# Altium schematic sheet LKS_0313-V1.0.SchDoc: LKS034DO_FOC_MOTOR
size C; Date: 20220518; DrawnBy: WPJ; Organization: PuXun Tech Co.Ltd.; Revision: V1.0; PageSetup: Record=PageOptions?CenterHorizontal=True?CenterVertical=True?PrintScale=0.54?XCorrection=1.00?YCorrection=1.00?PrintKind=0?BorderSize=5000000?LeftOffset=0?BottomOffset=0?Orientation=2?PaperLength=1000?PaperWidth=1000?Scale=100?PaperSource=7?PrintQuality=-4?MediaType=1?DitherType=10?PaperKind=A4?PrintScaleMode=1
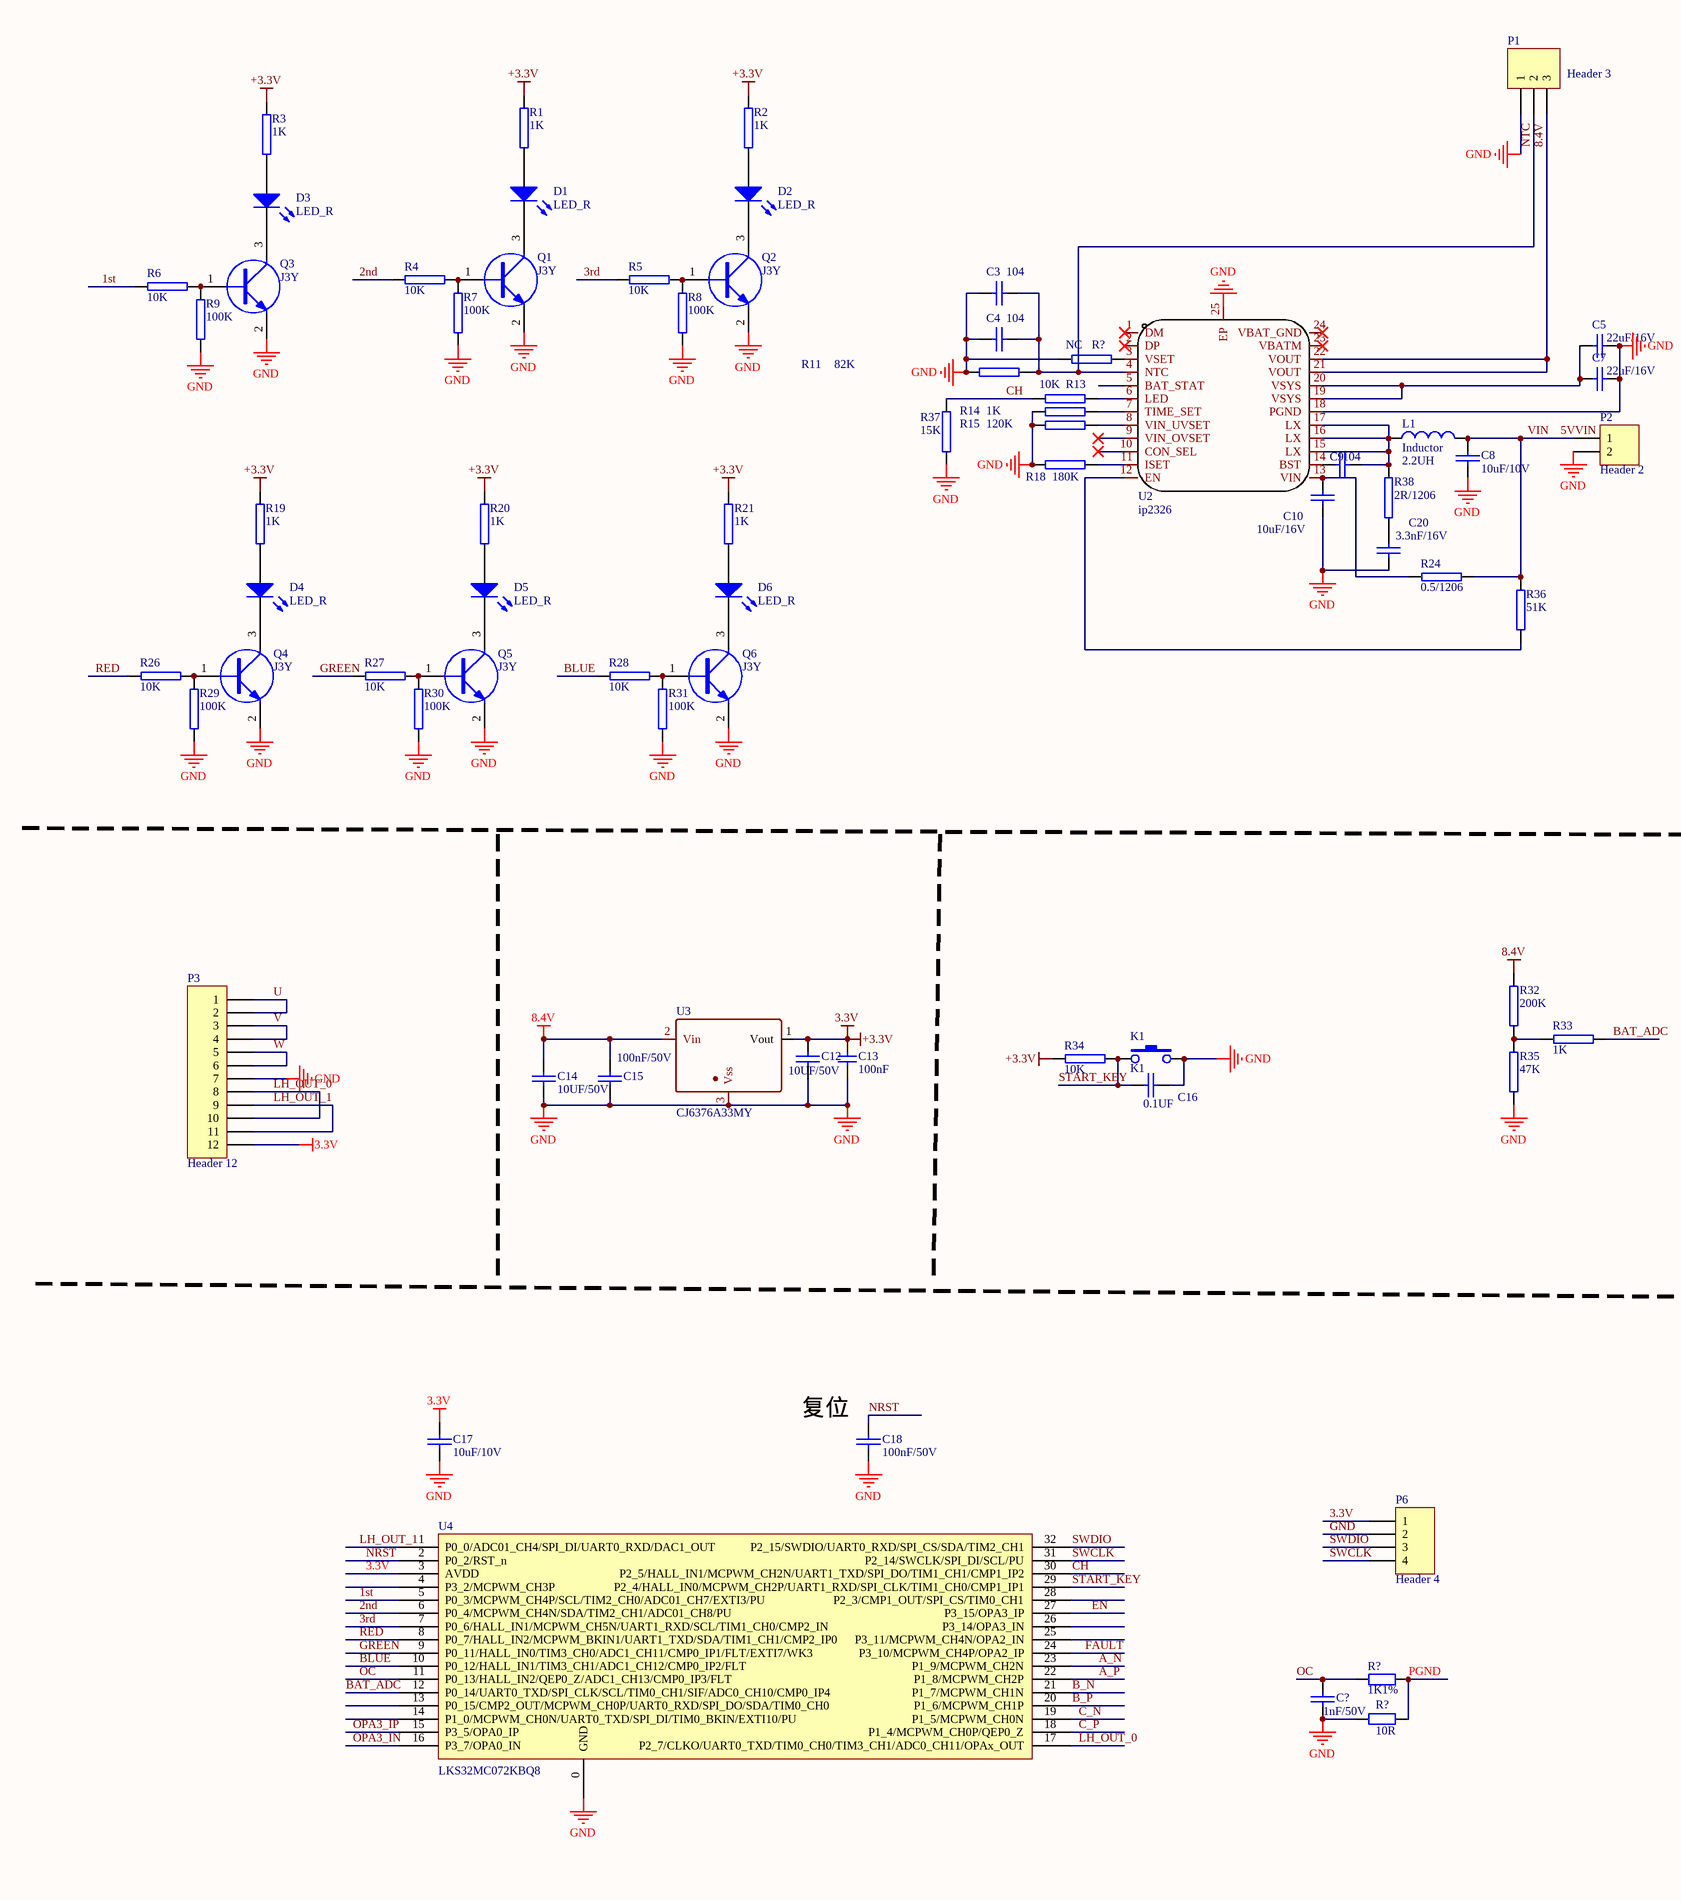
[diagram p0: LKS_0313-V1.0.SchDoc, left]
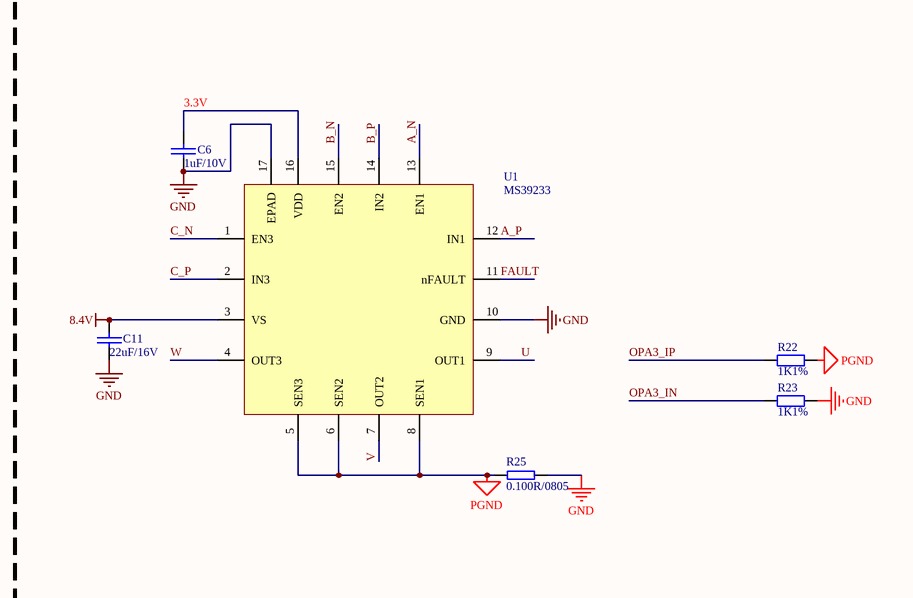
[diagram p1: LKS_0313-V1.0.SchDoc, right]

## Parts
(Parts that share a designator on the sheet are numbered #1, #2 ... from top to bottom, then left to right.)
C3  104  [C 0402_M]
C4  104  [C 0402_M]
C5  22uF/16V  [C 0402_M]
C6  1uF/10V  [C 0402_M]
C7  22uF/16V  [C 0402_M]
C8  10uF/10V  [C 0402_M]
C9  104  [C 0402_M]
C10  10uF/16V  [C 0402_M]
C11  22uF/16V  [C 0805_M]
C12  10UF/50V  [0805C]
C13  100nF  [0402]
C14  10UF/50V  [0805C]
C15  100nF/50V  [0402]
C16  0.1UF  [0603_RON]
C17  10uF/10V  [C 0402_M]
C18  100nF/50V  [C 0402_M]
C20  3.3nF/16V  [C 0402_M]
C?  1nF/50V  [0603C]
D1  LED_R  [SMDLED]
D2  LED_R  [SMDLED]
D3  LED_R  [SMDLED]
D4  LED_R  [SMDLED]
D5  LED_R  [SMDLED]
D6  LED_R  [SMDLED]
K1  K1  [Button3x4x2]
L1  Inductor  value 2.2UH  [0402-A]
P1  Header 3  [HDR1X3]
P2  Header 2  [HDR1X2]
P3  Header 12  [SMD-12]
P6  Header 4  [HDR1X4]
Q1  J3Y  [SOT-23]
Q2  J3Y  [SOT-23]
Q3  J3Y  [SOT-23]
Q4  J3Y  [SOT-23]
Q5  J3Y  [SOT-23]
Q6  J3Y  [SOT-23]
R1  1K  [0603_RON]
R2  1K  [0603_RON]
R3  1K  [0603_RON]
R4  10K  [0603_RON]
R5  10K  [0603_RON]
R6  10K  [0603_RON]
R7  100K  [0603_RON]
R8  100K  [0603_RON]
R9  100K  [0603_RON]
R11  82K  [0603_RON]
R13  10K  [0603_RON]
R14  1K  [0603_RON]
R15  120K  [0603_RON]
R18  180K  [0603_RON]
R19  1K  [0603_RON]
R20  1K  [0603_RON]
R21  1K  [0603_RON]
R22  1K1%  [R 0402_M]
R23  1K1%  [R 0402_M]
R24  0.5/1206  [0603_RON]
R25  0.100R/0805  [R 0805_M]
R26  10K  [0603_RON]
R27  10K  [0603_RON]
R28  10K  [0603_RON]
R29  100K  [0603_RON]
R30  100K  [0603_RON]
R31  100K  [0603_RON]
R32  200K  [0603_RON]
R33  1K  [0603_RON]
R34  10K  [0603_RON]
R35  47K  [0603_RON]
R36  51K  [0603_RON]
R37  15K  [0603_RON]
R38  2R/1206  [0603_RON]
R?#1  NC  [0603_RON]
R?#2  1K1%  [0603R]
R?#3  10R  [0603R]
U1  MS39233  [QFN16]
U2  ip2326
U3  CJ6376A33MY  [SOT89-3]
U4  LKS32MC072KBQ8  [QFN32 5x5_M]

## Nets
3.3V: C6.2 C12.2 C13.1 C17.2 P3.12 P6.1 R1.2 R2.2 R3.2 R19.2 R20.2 R21.2 R34.2 U1.16(VDD) U3.1(Vout) U4.3(AVDD)  [also labelled +3.3V]
8.4V: C11.2 C14.2 C15.1 P1.3 R32.1 U1.3(VS) U2.21(VOUT) U2.22(VOUT) U3.2(Vin)
GND: C3.2 C4.2 C5.1 C6.1 C7.1 C8.2 C10.2 C11.1 C12.1 C13.2 C14.1 C15.2 C16.2 C17.1 C18.2 C20.2 C?.1 K1.2 P1.1 P2.2 P3.7 P6.2 Q1.2(E) Q2.2(E) Q3.2(E) Q4.2(E) Q5.2(E) Q6.2(E) R7.2 R8.2 R9.2 R11.2 R14.2 R15.2 R18.2 R23.1 R25.2 R29.2 R30.2 R31.2 R35.2 R37.2 R?#1.2 R?#3.2 U1.10(GND) U1.17(EPAD) U2.18(PGND) U2.25(EP) U3.3(Vss) U4.0(GND)
PGND: R22.1 R25.1 R?#2.2 R?#3.1 U1.5(SEN3) U1.6(SEN2) U1.8(SEN1)
1st: R6.2 U4.5(P0_3/MCPWM_CH4P/SCL/TIM2_CH0/ADC01_CH7/EXTI3/PU)
2nd: R4.2 U4.6(P0_4/MCPWM_CH4N/SDA/TIM2_CH1/ADC01_CH8/PU)
3rd: R5.2 U4.7(P0_6/HALL_IN1/MCPWM_CH5N/UART1_RXD/SCL/TIM1_CH0/CMP2_IN)
5VVIN: C8.1 L1.2 P2.1 R24.1 R36.1  [also labelled VIN]
A_N: U1.13(EN1) U4.23(P1_9/MCPWM_CH2N)
A_P: U1.12(IN1) U4.22(P1_8/MCPWM_CH2P)
B_N: U1.15(EN2) U4.21(P1_7/MCPWM_CH1N)
B_P: U1.14(IN2) U4.20(P1_6/MCPWM_CH1P)
BAT_ADC: R33.1 U4.12(P0_14/UART0_TXD/SPI_CLK/SCL/TIM0_CH1/SIF/ADC0_CH10/CMP0_IP4)
BLUE: R28.2 U4.10(P0_12/HALL_IN1/TIM3_CH1/ADC1_CH12/CMP0_IP2/FLT)
C_N: U1.1(EN3) U4.19(P1_5/MCPWM_CH0N)
C_P: U1.2(IN3) U4.18(P1_4/MCPWM_CH0P/QEP0_Z)
CH: R13.2 R37.1 U4.30(P2_5/HALL_IN1/MCPWM_CH2N/UART1_TXD/SPI_DO/TIM1_CH1/CMP1_IP2)
EN: U4.27(P3_15/OPA3_IP)
FAULT: U1.11(nFAULT) U4.24(P3_10/MCPWM_CH4P/OPA2_IP)
GREEN: R27.2 U4.9(P0_11/HALL_IN0/TIM3_CH0/ADC1_CH11/CMP0_IP1/FLT/EXTI7/WK3)
LH_OUT_0: P3.8 P3.10 U4.17(P2_7/CLKO/UART0_TXD/TIM0_CH0/TIM3_CH1/ADC0_CH11/OPAx_OUT)
LH_OUT_1: P3.9 P3.11 U4.1(P0_0/ADC01_CH4/SPI_DI/UART0_RXD/DAC1_OUT)
NRST: C18.1 U4.2(P0_2/RST_n)
NTC: C3.1 C4.1 P1.2 R11.1 U2.4(NTC)
OC: C?.2 R?#2.1 U4.11(P0_13/HALL_IN2/QEP0_Z/ADC1_CH13/CMP0_IP3/FLT)
OPA3_IN: R23.2 U4.16(P3_7/OPA0_IN)
OPA3_IP: R22.2 U4.15(P3_5/OPA0_IP)
RED: R26.2 U4.8(P0_7/HALL_IN2/MCPWM_BKIN1/UART1_TXD/SDA/TIM1_CH1/CMP2_IP0)
START_KEY: C16.1 K1.1 R34.1 U4.29(P2_4/HALL_IN0/MCPWM_CH2P/UART1_RXD/SPI_CLK/TIM1_CH0/CMP1_IP1)
SWCLK: P6.4 U4.31(P2_14/SWCLK/SPI_DI/SCL/PU)
SWDIO: P6.3 U4.32(P2_15/SWDIO/UART0_RXD/SPI_CS/SDA/TIM2_CH1)
U: P3.1 P3.2 U1.9(OUT1)
V: P3.3 P3.4 U1.7(OUT2)
W: P3.5 P3.6 U1.4(OUT3)
NetC5_2: C5.2 C7.2 U2.19(VSYS) U2.20(VSYS)
NetC9_1: C9.1 U2.14(BST)
NetC9_2: C9.2 L1.1 R38.1 U2.15(LX) U2.16(LX) U2.17(LX)
NetC10_1: C10.1 R24.2 U2.13(VIN)
NetC20_1: C20.1 R38.2
NetD1_1: D1.1(A) R1.1
NetD1_2: D1.2(K) Q1.3(C)
NetD2_1: D2.1(A) R2.1
NetD2_2: D2.2(K) Q2.3(C)
NetD3_1: D3.1(A) R3.1
NetD3_2: D3.2(K) Q3.3(C)
NetD4_1: D4.1(A) R19.1
NetD4_2: D4.2(K) Q4.3(C)
NetD5_1: D5.1(A) R20.1
NetD5_2: D5.2(K) Q5.3(C)
NetD6_1: D6.1(A) R21.1
NetD6_2: D6.2(K) Q6.3(C)
NetQ1_1: Q1.1(B) R4.1 R7.1
NetQ2_1: Q2.1(B) R5.1 R8.1
NetQ3_1: Q3.1(B) R6.1 R9.1
NetQ4_1: Q4.1(B) R26.1 R29.1
NetQ5_1: Q5.1(B) R27.1 R30.1
NetQ6_1: Q6.1(B) R28.1 R31.1
NetR13_1: R13.1 U2.6(LED)
NetR14_1: R14.1 U2.7(TIME_SET)
NetR15_1: R15.1 U2.8(VIN_UVSET)
NetR18_1: R18.1 U2.11(ISET)
NetR32_2: R32.2 R33.2 R35.1
NetR36_2: R36.2 U2.12(EN)
NetR?#1_1: R?#1.1 U2.3(VSET)

Not connected (* = marked no-connect by the designer): U2 1(DM)* 2(DP)* 5(BAT_STAT) 9(VIN_OVSET)* 10(CON_SEL)* 23(VBATM)* 24(VBAT_GND)*; U4 4(P3_2/MCPWM_CH3P) 13(P0_15/CMP2_OUT/MCPWM_CH0P/UART0_RXD/SPI_DO/SDA/TIM0_CH0) 14(P1_0/MCPWM_CH0N/UART0_TXD/SPI_DI/TIM0_BKIN/EXTI10/PU) 25(P3_11/MCPWM_CH4N/OPA2_IN) 26(P3_14/OPA3_IN) 28(P2_3/CMP1_OUT/SPI_CS/TIM0_CH1)

## Notes on the sheet
- (near C18) 复位
- TITLE：
- SIEZ：C
- VERSION：
- V1.0
- DESIGNER：
- COMPANY：
- DATE：

## Library data of the parts
C3-C11 C17 C18 C20 C? = C: Capacitor
C12 C14-C16 = CAP: Capacitor
C13 = CAP
D1-D6 = LED
L1 = Inductor: Code_IEC: 1005; Published: 8-Jun-2000; LatestRevisionDate: 17-Jul-2002; LatestRevisionNote: Re-released for DXP Platform.; PackageReference: 0402-A; Publisher: Altium Limited; Code_JEITA: 0402
P1 = Header 3: Header, 3-Pin; LatestRevisionDate: 17-Jul-2002; LatestRevisionNote: Re-released for DXP Platform.; Publisher: Altium Limited
P2 = Header 2: Header, 2-Pin; LatestRevisionDate: 17-Jul-2002; LatestRevisionNote: Re-released for DXP Platform.; Publisher: Altium Limited
P3 = Header 12: Header, 12-Pin; LatestRevisionDate: 17-Jul-2002; LatestRevisionNote: Re-released for DXP Platform.; Publisher: Altium Limited
P6 = Header 4: Header, 4-Pin; LatestRevisionDate: 17-Jul-2002; LatestRevisionNote: Re-released for DXP Platform.; Publisher: Altium Limited
Q1-Q6 = NPN: NPN Transistor
R1-R9 R11 R13-R15 R18-R21 R24 R26-R38 R?#1 = RES2_S
R22 R23 R?#2 R?#3 = Res: Resistor; Value: K; Published: 8-Jun-2000; LatestRevisionDate: 17-Jul-2002; LatestRevisionNote: Re-released for DXP Platform.; PackageReference: AXIAL-0.4; Publisher: Altium Limited; PackageDescription: Axial Device, Thru-Hole; 2 Leads; 0.4 in Pin Spacing
R25 = RES2短
U3 = 78L15
U4 = LKS32MC072KBQ82: LKS32MC072KBQ8 / 凌鸥创芯，128KFlash，12KRAM